# EAGLE design sat_001 (EAGLE 7.4.0)
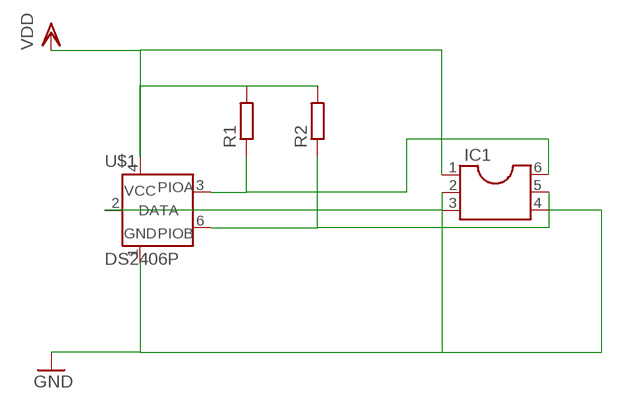
[diagram p0: schematic, sheet 1]

## Parts
IC1  DIL6  [DIL06]
R1  R-EU_R0805  [R0805]
R2  R-EU_R0805  [R0805]
U$1  DS2406P  [TSOC6]

## Nets
GND: IC1.3 IC1.4 U$1.1(GND)
N$1: IC1.6 R1.1 U$1.3(PIOA)
N$2: IC1.5 R2.1 U$1.6(PIOB)
N$4: IC1.2 U$1.2(DATA)
VDD: IC1.1 R1.2 R2.2 U$1.4(VCC)

## Library data of the parts
IC1 = ic-package_own:DIL6: Dual In Line / Socket
R1 R2 = resistor:R-EU_: RESISTOR, European symbol
U$1 = maxim_own:DS2406P

## Board
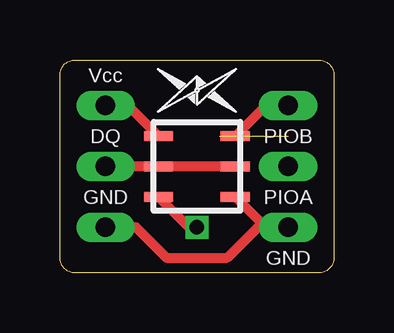
[diagram p1: board, top side]
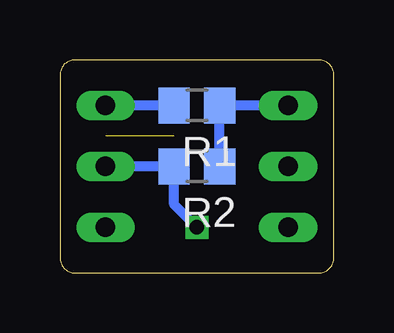
[diagram p2: board, bottom side, seen from below]

Size 11.43 x 8.89 mm. Coordinates in mm from the lower left corner, seen from the top.
Outline: 0,0.64 0,8.26 arc-90 0.64,8.89 10.79,8.89 arc-90 11.43,8.26 11.43,0.64 arc-90 10.79,0 0.64,0 arc-90 0,0.64
Copper layers (1*16): Top 0.0356mm / dielectric 1.5011mm / Bottom 0.0356mm
Design rules "sheet1_02": minimum track width 6mil, minimum drill 13mil, track to track 6mil, track to pad 6mil, pad to pad 6mil, via to via 6mil, smd to smd 6mil, copper to edge 15mil, drill to drill 6mil, minimum pad ring 7mil, minimum via ring 7mil, stop-mask expansion 4mil, vias tented up to drill 0mil, thermal gap 10mil

### Footprints (pad centres in the part's own frame; a part is rotated, then mirrored left to right if it is on the bottom)
DIL06 = drill 0.813 long: 1 -2.54,-3.81; 2 0,-3.81; 3 2.54,-3.81; 4 2.54,3.81; 5 0,3.81; 6 -2.54,3.81
R0805 = smd 1.3 x 1.5: 1 -0.95,0; 2 0.95,0
TSOC6 = smd 0.406 x 1.219: 1 -1.27,-1.6; 2 0,-1.6; 3 1.27,-1.6; 4 1.27,1.6; 5 0,1.6; 6 -1.27,1.6

### Placement (x,y rotation side)
IC1  5.71,4.45 270 top
R1  5.71,6.99 0 bottom
R2  5.71,4.45 0 bottom
U$1  5.71,4.45 90 top
U$2  [LOGO_SMAL]  4.45,6.35 0 top

### Tracks (layer width: path | path; a pad name or v marks a point on that pad's centre or on a via)
GND
  Top 0.406: U$1.1 8.59,1.91 IC1.4 8.26,1.91 6.99,0.64 4.45,0.64 3.17,1.91 IC1.3
N$1  (1 unrouted)
  Top 0.406: U$1.3 8.59,6.99 IC1.6
  Bottom 0.406: R1.1 IC1.6
N$2  (via drill 0.6)
  Top 0.406: U$1.6 5.38,1.91 v5.71,1.91
  Bottom 0.406: v5.71,1.91 6.67,2.86 R2.1 IC1.5
N$4
  Top 0.406: U$1.2 IC1.2
VDD
  Top 0.406: U$1.4 2.84,6.99 IC1.1
  Bottom 0.406: IC1.1 R1.2 R2.2

### Text on the board
tNames: Vcc | DQ | PIOB | GND | PIOA | GND